# EasyEDA schematic SCH_CJ4 Audiopanel.json
TITLE: Sheet_1; REV: 1.0; Date: 2021-07-25; Sheet: 1/1; Drawn By: tuomas.kuosmanen; Company: Your Company
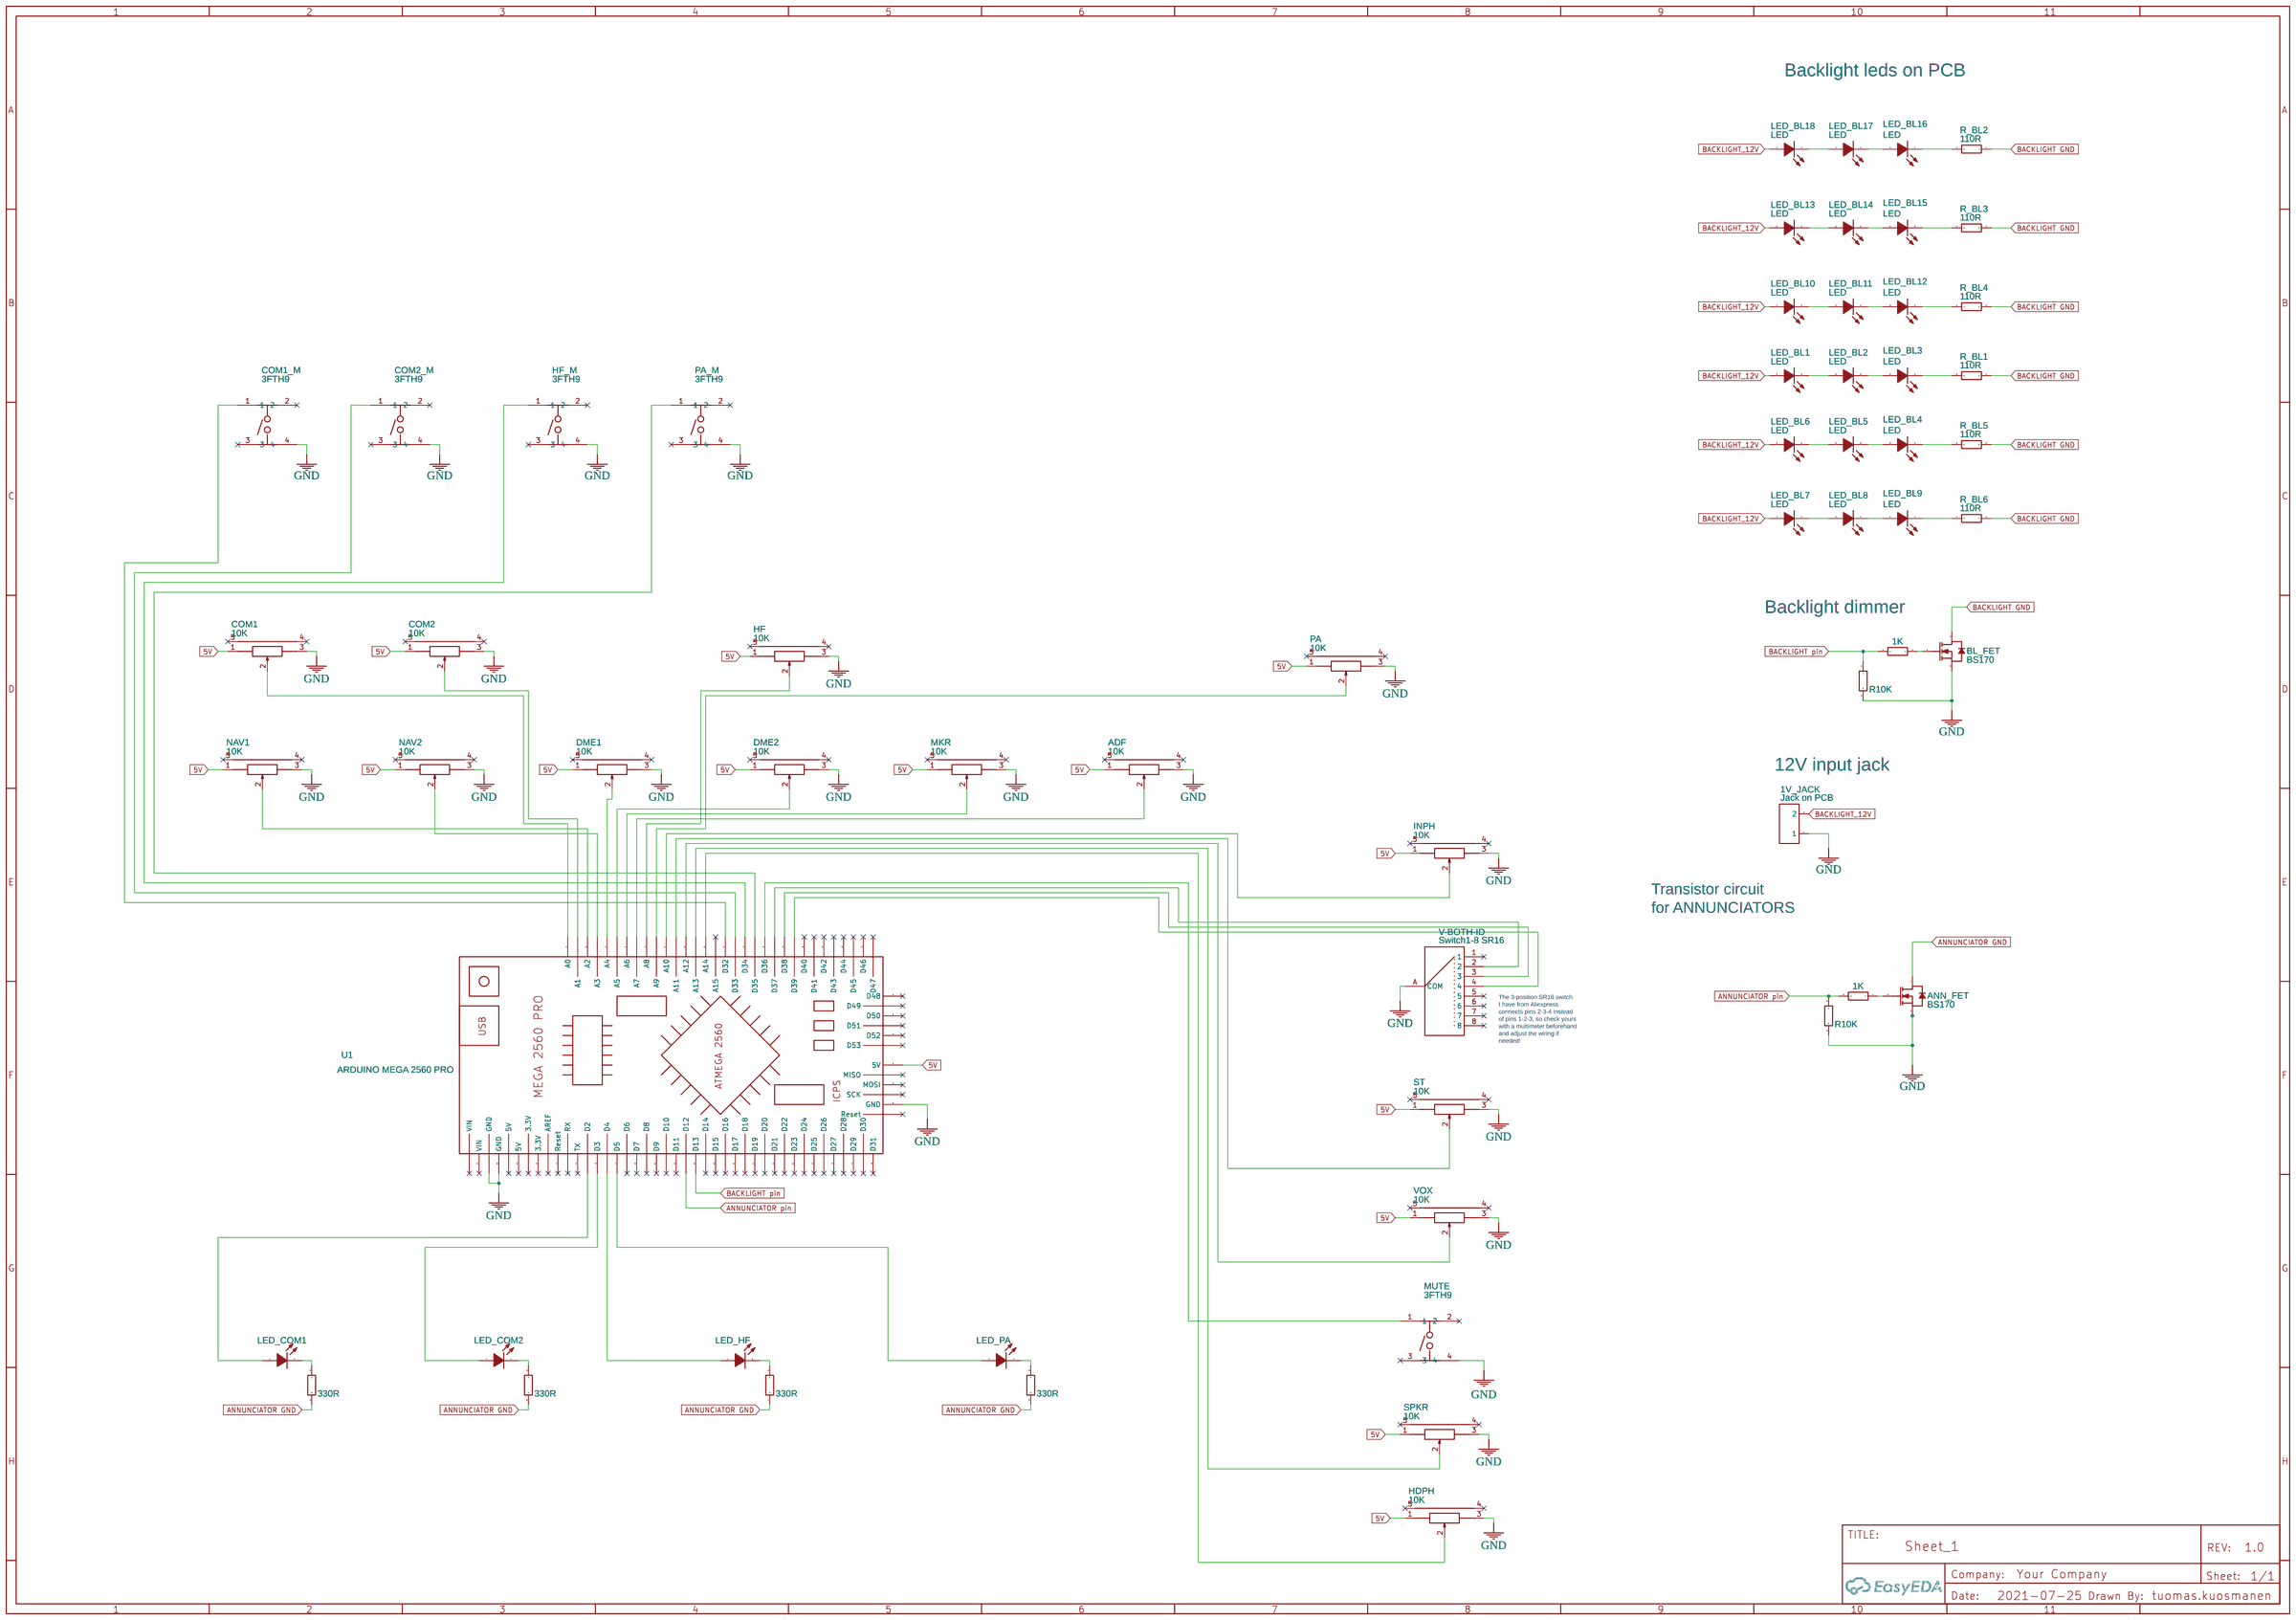
[diagram p0: schematic sheet]

## Parts
1_SURFACE_MOUNT_RESISTOR  330R  [R1206]
1MM_LED_THROUGH_HOLE  LED_COM2  [LED-TH_BD3.8-P2.54-FD]
1V_JACK  Jack on PCB  [JACK ON PCB]
2_SURFACE_MOUNT_RESISTOR  330R  [R1206]
2MM_LED_THROUGH_HOLE  LED_HF  [LED-TH_BD3.8-P2.54-FD]
3_SURFACE_MOUNT_RESISTOR  330R  [R1206]
3MM_LED_THROUGH_HOLE  LED_PA  [LED-TH_BD3.8-P2.54-FD]
4_SURFACE_MOUNT_RESISTOR  330R  [R1206]
5MM_LED_THROUGH_HOLE  LED_COM1  [LED-TH_BD3.8-P2.54-FD]
ADF  10K  [RES-TH_RK09K1130A70]
ANN_FET  BS170  [TO-92-3_L4.9-W3.7-P1.27-L]
BL_FET  BS170  [TO-92-3_L4.9-W3.7-P1.27-L]
COM1  10K  [RES-TH_RK09K1130A70]
COM1_M  3FTH9  [TACTILE]
COM2  10K  [RES-TH_RK09K1130A70]
COM2_M  3FTH9  [TACTILE]
DME1  10K  [RES-TH_RK09K1130A70]
DME2  10K  [RES-TH_RK09K1130A70]
HDPH  10K  [RES-TH_RK09K1130A70]
HF  10K  [RES-TH_RK09K1130A70]
HF_M  3FTH9  [TACTILE]
INPH  10K  [RES-TH_RK09K1130A70]
LED_BL1  LED  [LED1206-RD]
LED_BL2  LED  [LED1206-RD]
LED_BL3  LED  [LED1206-RD]
LED_BL4  LED  [LED1206-RD]
LED_BL5  LED  [LED1206-RD]
LED_BL6  LED  [LED1206-RD]
LED_BL7  LED  [LED1206-RD]
LED_BL8  LED  [LED1206-RD]
LED_BL9  LED  [LED1206-RD]
LED_BL10  LED  [LED1206-RD]
LED_BL11  LED  [LED1206-RD]
LED_BL12  LED  [LED1206-RD]
LED_BL13  LED  [LED1206-RD]
LED_BL14  LED  [LED1206-RD]
LED_BL15  LED  [LED1206-RD]
LED_BL16  LED  [LED1206-RD]
LED_BL17  LED  [LED1206-RD]
LED_BL18  LED  [LED1206-RD]
MKR  10K  [RES-TH_RK09K1130A70]
MUTE  3FTH9  [TACTILE]
NAV1  10K  [RES-TH_RK09K1130A70]
NAV2  10K  [RES-TH_RK09K1130A70]
PA  10K  [RES-TH_RK09K1130A70]
PA_M  3FTH9  [TACTILE]
R_ANN1  1K  [R1206]
R_ANN2  R10K  [R1206]
R_ANN3  R10K  [R1206]
R_ANN4  1K  [R1206]
R_BL1  110R  [R1206]
R_BL2  110R  [R1206]
R_BL3  110R  [R1206]
R_BL4  110R  [R1206]
R_BL5  110R  [R1206]
R_BL6  110R  [R1206]
SPKR  10K  [RES-TH_RK09K1130A70]
ST  10K  [RES-TH_RK09K1130A70]
U1  ARDUINO MEGA 2560 PRO  [ARDUINO MEGA 2560 PRO]
V-BOTH-ID  Switch1-8 SR16  [SWITCH_SR16_1_8]
VOX  10K  [RES-TH_RK09K1130A70]

## Library data of the parts
1_SURFACE_MOUNT_RESISTOR 2_SURFACE_MOUNT_RESISTOR 3_SURFACE_MOUNT_RESISTOR 4_SURFACE_MOUNT_RESISTOR = 1206W4F330LT5E: Supplier: LCSC; Manufacturer: UniOhm; Supplier Part: C25337; JLCPCB Part Class: Extended Part
1MM_LED_THROUGH_HOLE 2MM_LED_THROUGH_HOLE 3MM_LED_THROUGH_HOLE 5MM_LED_THROUGH_HOLE = LEDOrange orange 3AO4UD: Supplier: LCSC; Manufacturer: KENTO; Supplier Part: C62095
1V_JACK = J-Header-Male-2.54_1x2: Manufacturer: TE Connectivity; image: //image.lceda.cn/szlcsc/C86471.jpg; link: //image.lceda.cn/szlcsc/C86471.jpg; Package Display: No
ADF COM1 COM2 DME1 DME2 HDPH HF INPH MKR NAV1 NAV2 PA SPKR ST VOX = RK09K1130A70: Supplier: LCSC; Supplier Part: C351173; Manufacturer: ALPS Electric; Contributor: LCSC; JLCPCB Part Class: Extended Part
ANN_FET BL_FET = BS170: Supplier: LCSC; Manufacturer: FAIRCHILD; Supplier Part: C111691; JLCPCB Part Class: Extended Part
COM1_M COM2_M HF_M MUTE PA_M = 3FTH9: Manufacturer: MEC Switches; Supplier: Digi-Key; Supplier Part: 679-3730-5-ND; link: https://octopart.com/3fth9-mec+switches-49180836; Contributor: Goose83
LED_BL1-LED_BL18 = HQ17-2102UYOC: Supplier: LCSC; Manufacturer: HARVATEK; Contributor: LCSC; Supplier Part: C154481; JLCPCB Part Class: Extended Part
R_ANN1-R_ANN4 R_BL1-R_BL6 = 1206W4J0331T5E: Supplier: LCSC; Manufacturer: UniOhm; Supplier Part: C25374
U1 = ARDUINO MEGA 2560 PRO: Manufacturer Part: Arduino Mega 2560 Pro Mini; link: https://robotdyn.com/mega-2560-pro-embed-ch340g-atmega2560-16au.html; Contributor: DEVAZ
V-BOTH-ID = Switch1-8 SR16: Supplier Part: SR16_1/8; Contributor: ivsnew

## Nets
5V: ADF.1 COM1.1 COM2.1 DME1.1 DME2.1 HDPH.1 HF.1 INPH.1 MKR.1 NAV1.1 NAV2.1 PA.1 SPKR.1 ST.1 U1.39(5V) VOX.1
GND: 1V_JACK.1 ADF.3 ANN_FET.3(S) BL_FET.3(S) COM1.3 COM1_M.4 COM2.3 COM2_M.4 DME1.3 DME2.3 HDPH.3 HF.3 HF_M.4 INPH.3 MKR.3 MUTE.4 NAV1.3 NAV2.3 PA.3 PA_M.4 R_ANN2.2 R_ANN3.2 SPKR.3 ST.3 U1.43(GND) U1.83(GND) U1.84(GND) V-BOTH-ID.A(COM) VOX.3
ANNUNCIATOR GND: 1_SURFACE_MOUNT_RESISTOR.1 2_SURFACE_MOUNT_RESISTOR.1 3_SURFACE_MOUNT_RESISTOR.1 4_SURFACE_MOUNT_RESISTOR.1 ANN_FET.1(D)
ANNUNCIATOR pin: R_ANN1.2 R_ANN2.1 U1.64(D12)
BACKLIGHT GND: BL_FET.1(D) R_BL1.1 R_BL2.1 R_BL3.1 R_BL4.1 R_BL5.1 R_BL6.1
BACKLIGHT pin: R_ANN3.1 R_ANN4.2 U1.63(D13)
BACKLIGHT_12V: 1V_JACK.2 LED_BL1.2(A) LED_BL6.2(A) LED_BL7.2(A) LED_BL10.2(A) LED_BL13.2(A) LED_BL18.2(A)
Net-(1_SURFACE_MOUNT_RESISTOR-2): 1_SURFACE_MOUNT_RESISTOR.2 1MM_LED_THROUGH_HOLE.2(K)
Net-(1MM_LED_THROUGH_HOLE-1): 1MM_LED_THROUGH_HOLE.1(A) U1.73(D3)
Net-(2_SURFACE_MOUNT_RESISTOR-2): 2_SURFACE_MOUNT_RESISTOR.2 5MM_LED_THROUGH_HOLE.2(K)
Net-(2MM_LED_THROUGH_HOLE-1): 2MM_LED_THROUGH_HOLE.1(A) U1.72(D4)
Net-(2MM_LED_THROUGH_HOLE-2): 2MM_LED_THROUGH_HOLE.2(K) 3_SURFACE_MOUNT_RESISTOR.2
Net-(3MM_LED_THROUGH_HOLE-1): 3MM_LED_THROUGH_HOLE.1(A) U1.71(D5)
Net-(3MM_LED_THROUGH_HOLE-2): 3MM_LED_THROUGH_HOLE.2(K) 4_SURFACE_MOUNT_RESISTOR.2
Net-(5MM_LED_THROUGH_HOLE-1): 5MM_LED_THROUGH_HOLE.1(A) U1.74(D2)
Net-(ADF-2): ADF.2 U1.8(A7)
Net-(ANN_FET-2): ANN_FET.2(G) R_ANN1.1
Net-(BL_FET-2): BL_FET.2(G) R_ANN4.1
Net-(COM1-2): COM1.2 U1.1(A0)
Net-(COM1_M-1): COM1_M.1 U1.17(D32)
Net-(COM2-2): COM2.2 U1.2(A1)
Net-(COM2_M-1): COM2_M.1 U1.18(D33)
Net-(DME1-2): DME1.2 U1.5(A4)
Net-(DME2-2): DME2.2 U1.6(A5)
Net-(HDPH-2): HDPH.2 U1.15(A14)
Net-(HF-2): HF.2 U1.9(A8)
Net-(HF_M-1): HF_M.1 U1.19(D34)
Net-(INPH-2): INPH.2 U1.11(A10)
Net-(LED_BL1-1): LED_BL1.1(K) LED_BL2.2(A)
Net-(LED_BL2-1): LED_BL2.1(K) LED_BL3.2(A)
Net-(LED_BL3-1): LED_BL3.1(K) R_BL1.2
Net-(LED_BL4-1): LED_BL4.1(K) R_BL5.2
Net-(LED_BL4-2): LED_BL4.2(A) LED_BL5.1(K)
Net-(LED_BL5-2): LED_BL5.2(A) LED_BL6.1(K)
Net-(LED_BL7-1): LED_BL7.1(K) LED_BL8.2(A)
Net-(LED_BL8-1): LED_BL8.1(K) LED_BL9.2(A)
Net-(LED_BL9-1): LED_BL9.1(K) R_BL6.2
Net-(LED_BL10-1): LED_BL10.1(K) LED_BL11.2(A)
Net-(LED_BL11-1): LED_BL11.1(K) LED_BL12.2(A)
Net-(LED_BL12-1): LED_BL12.1(K) R_BL4.2
Net-(LED_BL13-1): LED_BL13.1(K) LED_BL14.2(A)
Net-(LED_BL14-1): LED_BL14.1(K) LED_BL15.2(A)
Net-(LED_BL15-1): LED_BL15.1(K) R_BL3.2
Net-(LED_BL16-1): LED_BL16.1(K) R_BL2.2
Net-(LED_BL16-2): LED_BL16.2(A) LED_BL17.1(K)
Net-(LED_BL17-2): LED_BL17.2(A) LED_BL18.1(K)
Net-(MKR-2): MKR.2 U1.7(A6)
Net-(MUTE-1): MUTE.1 U1.21(D36)
Net-(NAV1-2): NAV1.2 U1.3(A2)
Net-(NAV2-2): NAV2.2 U1.4(A3)
Net-(PA-2): PA.2 U1.10(A9)
Net-(PA_M-1): PA_M.1 U1.20(D35)
Net-(SPKR-2): SPKR.2 U1.14(A13)
Net-(ST-2): ST.2 U1.12(A11)
Net-(U1-13): U1.13(A12) VOX.2
Net-(U1-22): U1.22(D37) V-BOTH-ID.2
Net-(U1-23): U1.23(D38) V-BOTH-ID.3
Net-(U1-24): U1.24(D39) V-BOTH-ID.4

Not connected (* = marked no-connect by the designer): ADF 4(EH)* 5(EH)*; COM1 4(EH)* 5(EH)*; COM1_M 2* 3*; COM2 4(EH)* 5(EH)*; COM2_M 2* 3*; DME1 4(EH)* 5(EH)*; DME2 4(EH)* 5(EH)*; HDPH 4(EH)* 5(EH)*; HF 4(EH)* 5(EH)*; HF_M 2* 3*; INPH 4(EH)* 5(EH)*; MKR 4(EH)* 5(EH)*; MUTE 2* 3*; NAV1 4(EH)* 5(EH)*; NAV2 4(EH)* 5(EH)*; PA 4(EH)* 5(EH)*; PA_M 2* 3*; SPKR 4(EH)* 5(EH)*; ST 4(EH)* 5(EH)*; U1 16(A15)* 25(D40)* 26(D41)* 27(D42)* 28(D43)* 29(D44)* 30(D45)* 31(D46)* 32(D47)* 33(D48)* 34(D49)* 35(D50)* 36(D51)* 37(D52)* 38(D53)* 40(MISO)* 41(MOSI)* 42(SCK)* 44(Reset)* 45(D31)* 46(D30)* 47(D29)* 48(D28)* 49(D27)* 50(D26)* 51(D25)* 52(D24)* 53(D23)* 54(D22)* 55(D21)* 56(D20)* 57(D19)* 58(D18)* 59(D17)* 60(D16)* 61(D15)* 62(D14)* 65(D11)* 66(D10)* 67(D9)* 68(D8)* 69(D7)* 70(D6)* 75(TX)* 76(RX)* 77(Reset)* 78(AREF)* 79(3.3V)* 80(3.3V)* 81(5V)* 82(5V)* 85(VIN)* 86(VIN)*; V-BOTH-ID 1* 5* 6* 7* 8*; VOX 4(EH)* 5(EH)*

## Notes on the sheet
- Backlight leds on PCB
- Backlight dimmer
- 12V input jack
- Transistor circuit
  for ANNUNCIATORS
- The 3-position SR16 switch
  I have from Aliexpress
  connects pins 2-3-4 instead
  of pins 1-2-3, so check yours
  with a multimeter beforehand
  and adjust the wiring if
  needed!
